# EAGLE schematic schematic (EAGLE 6.2)
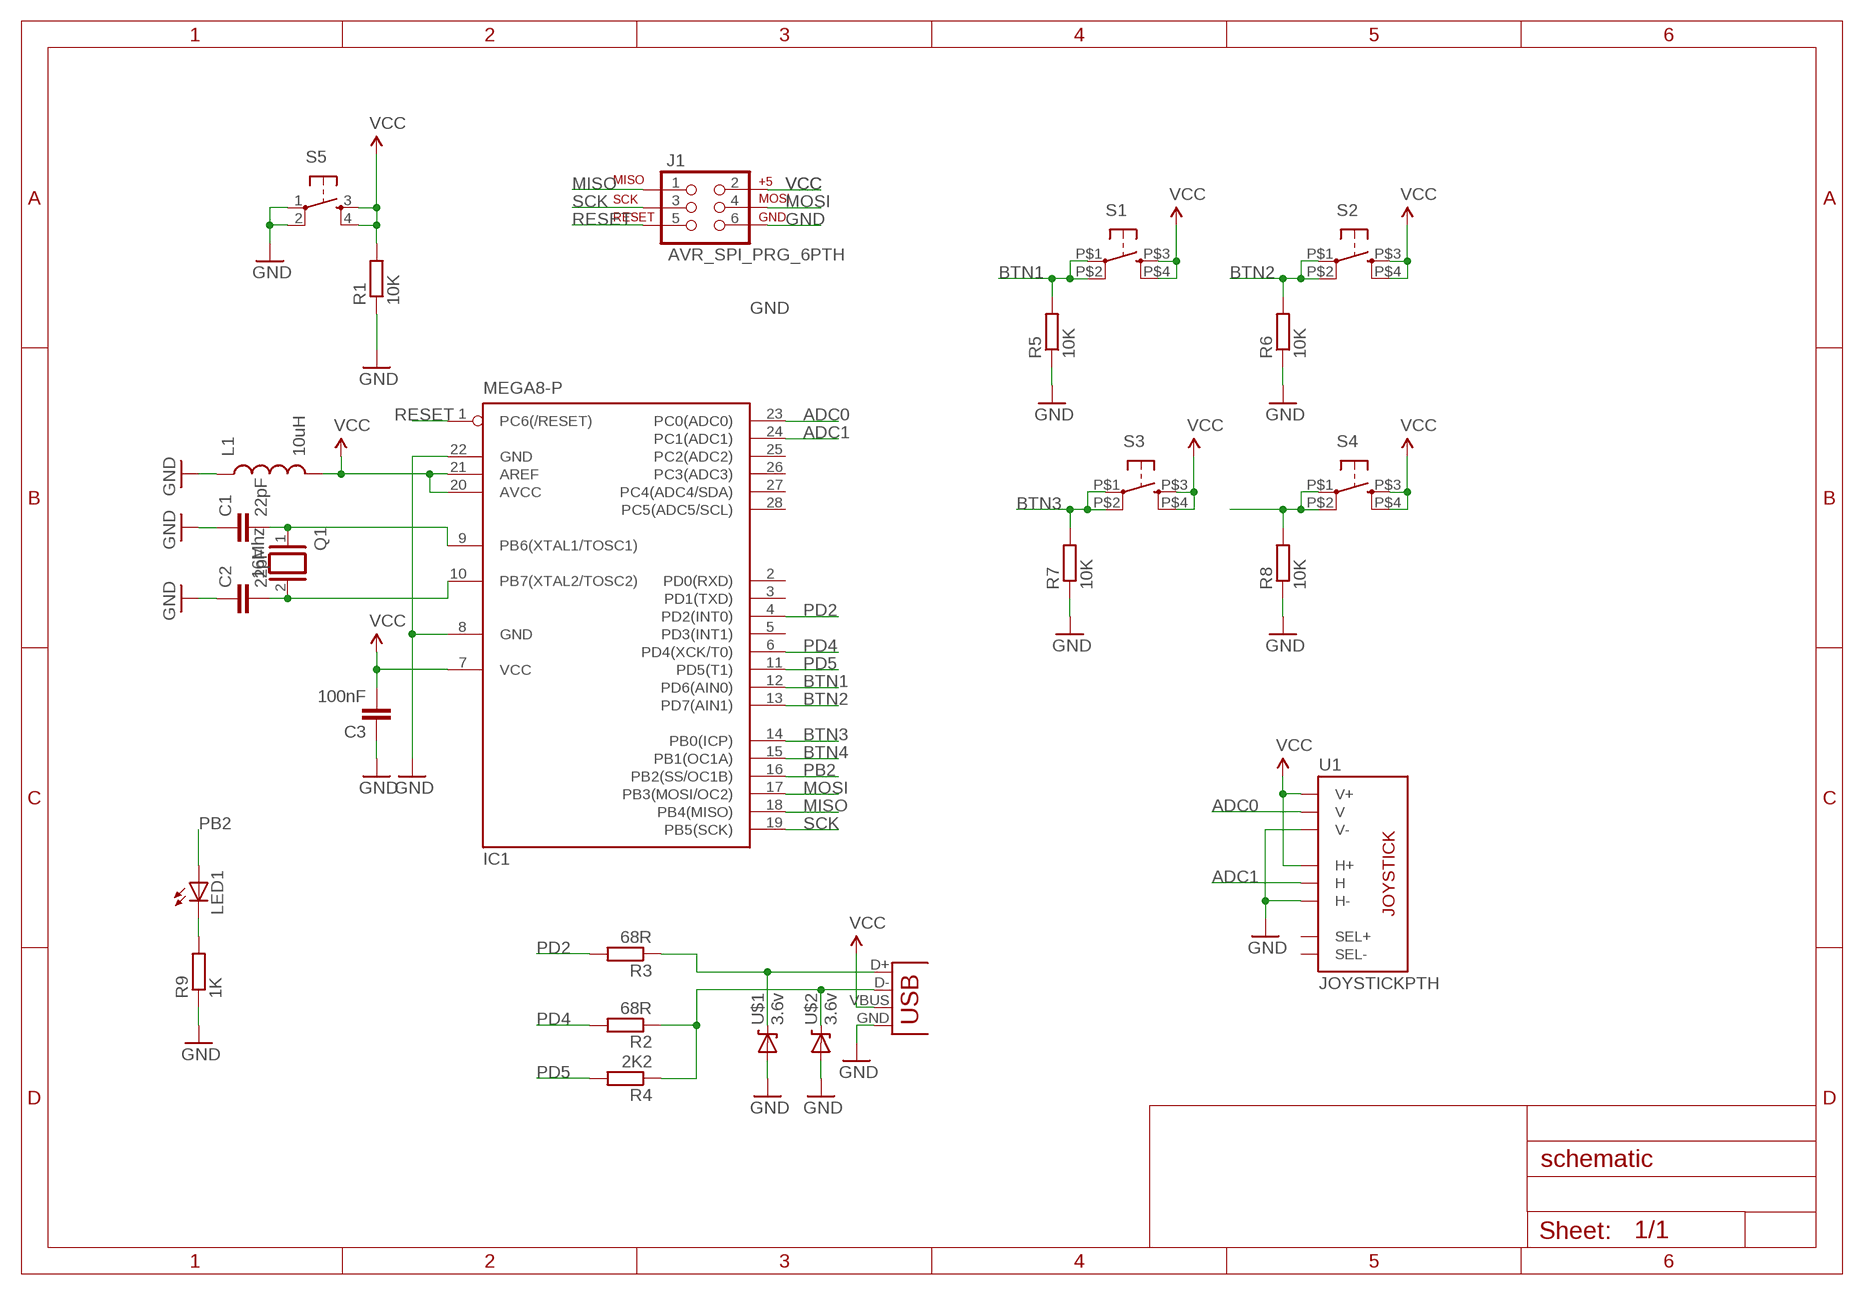
[diagram p0: schematic, sheet 1]

## Parts
C1  22pF  CAPKIT  [CAP-PTH-SMALL-KIT]
C2  22pF  CAPKIT  [CAP-PTH-SMALL-KIT]
C3  100nF  CAPKIT  [CAP-PTH-SMALL-KIT]
IC1  MEGA8-P  [DIL28-3]
J1  AVR_SPI_PRG_6PTH  [2X3]
L1  10uH  INDUCTORAXIAL-0.6  [AXIAL-0.6]
LED1  LED3MM  [LED3MM]
Q1  16Mhz  XTAL  [Q]
R1  10K  R-EU_0204/7  [0204/7]
R2  68R  R-EU_0204/7  [0204/7]
R3  68R  R-EU_0204/7  [0204/7]
R4  2K2  R-EU_0204/7  [0204/7]
R5  10K  R-EU_0204/7  [0204/7]
R6  10K  R-EU_0204/7  [0204/7]
R7  10K  R-EU_0204/7  [0204/7]
R8  10K  R-EU_0204/7  [0204/7]
R9  1K  R-EU_0204/7  [0204/7]
S1  TAC_SWITCHKSA_SEALED  [KSA_SEALED_TAC_SWITCH]
S2  TAC_SWITCHKSA_SEALED  [KSA_SEALED_TAC_SWITCH]
S3  TAC_SWITCHKSA_SEALED  [KSA_SEALED_TAC_SWITCH]
S4  TAC_SWITCHKSA_SEALED  [KSA_SEALED_TAC_SWITCH]
S5  TAC_SWITCHPTH  [TACTILE-PTH]
U1  JOYSTICKPTH  [JOYSTICK]
U$1  3.6v  DIODE-ZENERPTH  [DIODE-ZENER]
U$2  3.6v  DIODE-ZENERPTH  [DIODE-ZENER]
X1  USBPTH-VERTICAL  [USB-B-PTH-VERTICAL]

## Nets
ADC0: IC1.23(PC0(ADC0)) U1.V2(V)
ADC1: IC1.24(PC1(ADC1)) U1.H2(H)
BTN1: IC1.12(PD6(AIN0)) R5.2 S1.P$1 S1.P$2
BTN2: IC1.13(PD7(AIN1)) R6.2 S2.P$1 S2.P$2
BTN3: IC1.14(PB0(ICP)) R7.2 S3.P$1 S3.P$2
BTN4: IC1.15(PB1(OC1A)) R8.2 S4.P$1 S4.P$2
GND: C1.1 C2.1 C3.1 IC1.8(GND) IC1.22(GND) J1.6 L1.P$1 R1.1 R5.1 R6.1 R7.1 R8.1 R9.1 S5.1 S5.2 U1.H3(H-) U1.V3(V-) U$1.P$2(A) U$2.P$2(A) X1.GND
MISO: IC1.18(PB4(MISO)) J1.1
MOSI: IC1.17(PB3(MOSI/OC2)) J1.4
N$1: C1.2 IC1.9(PB6(XTAL1/TOSC1)) Q1.1
N$2: C2.2 IC1.10(PB7(XTAL2/TOSC2)) Q1.2
N$4: R3.1 U$1.P$1(C) X1.D+
N$5: LED1.K(C) R9.2
N$6: R2.1 R4.1 U$2.P$1(C) X1.D-
PB2: IC1.16(PB2(SS/OC1B)) LED1.A
PD2: IC1.4(PD2(INT0)) R3.2
PD4: IC1.6(PD4(XCK/T0)) R2.2
PD5: IC1.11(PD5(T1)) R4.2
RESET: IC1.1(PC6(/RESET)) J1.5
SCK: IC1.19(PB5(SCK)) J1.3
VCC: C3.2 IC1.7(VCC) IC1.20(AVCC) IC1.21(AREF) J1.2 L1.P$2 R1.2 S1.P$3 S1.P$4 S2.P$3 S2.P$4 S3.P$3 S3.P$4 S4.P$3 S4.P$4 S5.3 S5.4 U1.H1(H+) U1.V1(V+) X1.VBUS
Unconnected: IC1.2(PD0(RXD)) IC1.3(PD1(TXD)) IC1.5(PD3(INT1)) IC1.25(PC2(ADC2)) IC1.26(PC3(ADC3)) IC1.27(PC4(ADC4/SDA)) IC1.28(PC5(ADC5/SCL)) U1.B1A(SEL+) U1.B2A(SEL-)

## Library data of the parts
C1-C3 = SparkFun:CAP: Capacitor Standard 0603 ceramic capacitor, and 0.1" leaded capacitor.
IC1 = atmel:MEGA8-P: MICROCONTROLLER 8 Kbytes FLASH, 1 kbytes SRAM, 512 bytes EEPROM, USART, 4-channel 10 bit ADC, 2-channel 8 bit ADC Pin compatible with Atmega48, ATMega88, ATMega168 Source: avr.lbr; OC_FARNELL: unknown; OC_NEWARK: unknown
J1 = SparkFun:AVR_SPI_PRG_6: AVR ISP 6 Pin This is the reduced ISP connector for AVR programming. Common on Arduino. This footprint will take up less PCB space and can be used with a 10-pin to 6-pin adapter such as SKU: BOB-08508
L1 = SparkFun-Passives:INDUCTOR: Inductors Basic Inductor/Choke - 0603 and 1206. Footprints are not proven and vary greatly between part numbers.
LED1 = led:LED: LED OSRAM: - CHIPLED LG R971, LG N971, LY N971, LG Q971, LY Q971, LO R971, LY R971 LH N974, LH R974 LS Q976, LO Q976, LY Q976 LO Q996 - Hyper CHIPLED LW Q18S LB Q993, LB Q99A, LB R99A - SideLED LS A670, LO A670, LY A670, LG A670, LP A670 LB A673, LV A673, LT A673, LW A673 LH A674 LY A675 LS A676, LA A676, LO A676, LY A676, LW A676 LS A679, LY A679, LG A679 - Hyper Micro SIDELED® LS Y876, LA Y876, LO Y876, LY Y876 LT Y87S - SmartLED LW L88C, LW L88S LB L89C, LB L89S, LG L890 LS L89K, LO L89K, LY L89K LS L896, LA L896, LO L896, LY L896 - TOPLED LS T670, LO T670, LY T670, LG T670, LP T670 LSG T670, LSP T670, LSY T670, LOP T670, LYG T670 LG T671, LOG T671, LSG T671 LB T673, LV T673, LT T673, LW T673 LH T674 LS T676, LA T676, LO T676, LY T676, LB T676, LH T676, LSB T676, LW T676 LB T67C, LV T67C, LT T67C, LS T67K, LO T67K, LY T67K, LW E67C LS E67B, LA E67B, LO E67B, LY E67B, LB E67C, LV E67C, LT E67C LW T67C LS T679, LY T679, LG T679 LS T770, LO T770, LY T770, LG T770, LP T770 LB T773, LV T773, LT T773, LW T773 LH T774 LS E675, LA E675, LY E675, LS T675 LS T776, LA T776, LO T776, LY T776, LB T776 LHGB T686 LT T68C, LB T68C - Hyper Mini TOPLED® LB M676 - Mini TOPLED Santana® LG M470 LS M47K, LO M47K, LY M47K Source: http://www.osram.convergy.de LUXEON: - LUMILED® LXK2-PW12-R00, LXK2-PW12-S00, LXK2-PW14-U00, LXK2-PW14-V00 LXK2-PM12-R00, LXK2-PM12-S00, LXK2-PM14-U00 LXK2-PE12-Q00, LXK2-PE12-R00, LXK2-PE12-S00, LXK2-PE14-T00, LXK2-PE14-U00 LXK2-PB12-K00, LXK2-PB12-L00, LXK2-PB12-M00, LXK2-PB14-N00, LXK2-PB14-P00, LXK2-PB14-Q00 LXK2-PR12-L00, LXK2-PR12-M00, LXK2-PR14-Q00, LXK2-PR14-R00 LXK2-PD12-Q00, LXK2-PD12-R00, LXK2-PD12-S00 LXK2-PH12-R00, LXK2-PH12-S00 LXK2-PL12-P00, LXK2-PL12-Q00, LXK2-PL12-R00 Source: www.luxeon.com KINGBRIGHT: KA-3528ASYC Source: www.kingbright.com
Q1 = special:XTAL: CRYSTAL
R1-R9 = resistor:R-EU_: RESISTOR, European symbol
S1-S5 = SparkFun:TAC_SWITCH: Momentary Switch Button commonly used for reset or general input. Spark Fun Electronics SKU : COM-00097
U1 = SparkFun:JOYSTICK: Thumb Joystick Joystick commonly found in PS2 controllers. Two pots and a select switch. Footprint proven. Spark Fun Electronics SKU : COM-09032
U$1 U$2 = SparkFun:DIODE-ZENER: Zener Diode Production Part - 8199 3.4V Zener Voltage
X1 = SparkFun:USB: USB Connectors USB-B-PTH is fully proven SKU : PRT-00139 USB-miniB is fully proven SKU : PRT-00587 USB-A-PCB is untested. USB-A-H is throughly reviewed, but untested. Spark Fun Electronics SKU : PRT-00437 USB-B-SMT is throughly reviewed, but untested. Needs silkscreen touching up. USB-A-S has not been used/tested USB-MB-H has not been used/tested

## Net classes
0 default: width 0.254 mm, drill 0.051 mm, clearance 0.127 mm